# Altium schematic sheet Power.SchDoc
size A; SheetNumber: 4; SheetTotal: 5
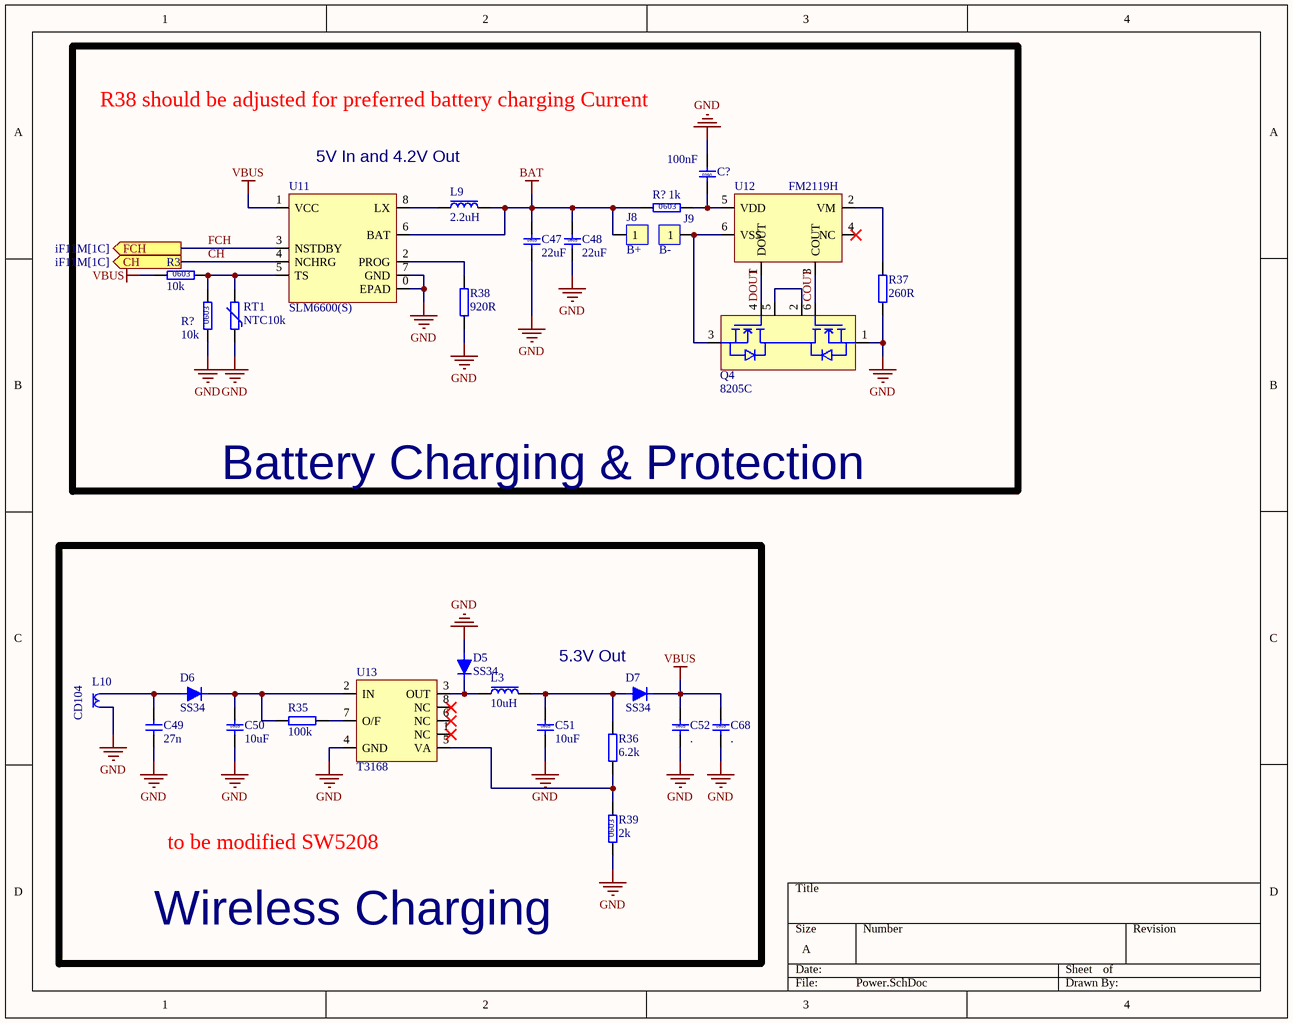
[diagram p0: Power.SchDoc]

## Parts
(Parts that share a designator on the sheet are numbered #1, #2 ... from top to bottom, then left to right.)
C47  22uF  [C0805]
C48  22uF  [C0805]
C49  27n  [C1206]
C50  10uF  [C0805]
C51  10uF  [C0805]
C52  .  [C0805]
C68  .  [C0805]
C?  100nF  [C0603]
D5  SS34  [SMB]
D6  SS34  [SMB]
D7  SS34  [SMB]
J8  B+  [batteryterminal]
J9  B-  [batteryterminal]
L3  10uH  [CD54]
L9  2.2uH  [CD54]
L10  CD104  [SMD PAD 1x2]
Q4  8205C  [SOT23-6]
R3  10k  [R0603-LD]
R35  100k  [R0805]
R36  6.2k  [R0603]
R37  260R  [R0603]
R38  920R  [R0603]
R39  2k  [R0603-LD]
R?#1  1k  [R0603-LD]
R?#2  10k  [R0603-LD]
RT1  NTC10k  [RT0603]
U11  SLM6600(S)  [SOP-8 - EPAD]
U12  FM2119H  [SOT23-6]
U13  T3168  [SOP-8]

## Blocks framed on the sheet
Battery Charging & Protection: C47 C48 C? J8 J9 L9 Q4 R3 R37 R38 R?#1 R?#2 RT1 U11 U12
Wireless Charging: C49-C52 C68 D5-D7 L3 L10 R35 R36 R39 U13

## Ports
CH (out, see iF11M[1C]), FCH (out, see iF11M[1C])

## Nets
BAT: C47.1 C48.1 J8.1 L9.2 R?#1.1 U11.6(BAT)
GND: C47.2 C48.2 C49.1 C50.2 C51.2 C52.2 C68.2 C?.2 D5.1(A) L10.1 Q4.1(S1) R37.1 R38.1 R39.1 R?#2.1 RT1.1 U11.0(EPAD) U11.7(GND) U13.4(GND)
VBUS: C52.1 C68.1 D7.2(K) R3.1 U11.1(VCC)
CH: U11.4(NCHRG) ; port CH
COUT: Q4.6(G1) U12.3(COUT)
DOUT: Q4.4(G2) U12.1(DOUT)
FCH: U11.3(NSTDBY) ; port FCH
NetC49_2: C49.2 D6.1(A) L10.2
NetC50_1: C50.1 D6.2(K) R35.2 U13.2(IN)
NetC51_1: C51.1 D7.1(A) L3.2 R36.2
NetC?_1: C?.1 R?#1.2 U12.5(VDD)
NetD5_2: D5.2(K) L3.1 U13.3(OUT)
NetJ9_1: J9.1 Q4.3(S2) U12.6(VSS)
NetL9_1: L9.1 U11.8(LX)
NetQ4_2: Q4.2(D1) Q4.5(D2)
NetR3_2: R3.2 R?#2.2 RT1.2 U11.5(TS)
NetR35_1: R35.1 U13.7(O/F)
NetR36_1: R36.1 R39.2 U13.5(VA)
NetR37_2: R37.2 U12.2(VM)
NetR38_2: R38.2 U11.2(PROG)

Not connected (* = marked no-connect by the designer): U12 4(NC)*; U13 1(NC)* 6(NC)* 8(NC)*

## Notes on the sheet
- R38 should be adjusted for preferred battery charging Current
- 5V In and 4.2V Out
- (near D7) 5.3V Out
- to be modified SW5208
- (in symbol C 0603 100nF 50V) 0603
- (in symbol C 0805 10uF 25V) 0805
- (in symbol C 0805 22uF 16V) 0805
- (in symbol R 0603 1k) 0603
- (in symbol R 0603 2k) 0603
- (in symbol R 0603 10k) 0603

## Library data of the parts
C47 C48 = C 0805 22uF 16V: 10% 16V; Part No: WP0005367; Material Name: 贴片电容0805 22UF/16V 10%; Product Code: WP0005367; Supplier: 深圳市四叶电子有限公司; Manufacturer: *
C49 = Capacitor: SMD resistor  Package; Part No: *; Product Code: *; Suppliers: 南京南山半导体有限公司; Manufacturer: *
C50-C52 C68 = C 0805 10uF 25V: 10% 25V; Part No: WP0005368; Material Name: 贴片电容0805 10UF/25V 10%; Product Code: WP0005368; Supplier: 深圳市四叶电子有限公司; Manufacturer: *
C? = C 0603 100nF 50V: 10% 50V; Part No: W-T-CA-X703N100K50VNT; Manufacturer: FENGHUA; Material Name: 贴片电容0603 100NF/50V 10%; Product Code: WP0002721; Supplier: 南京南山半导体有限公司
D5-D7 = Diode-smd
J8 J9 = batterypad: 1 Pin SMD Pad for Battery
L3 = CD54: SMD Inductor 10 uH CD54
L9 = CD54: SMD Inductor 2.2 uH CD54
L10 = Wcoil: SMD Inductor
Q4 = JST8205S: 20V N-channel enhancement MOS field effect transistor
R3 R?#2 = R 0603 10k: 5%; Part No: W-T-RE-RS03K103JT; Manufacturer: 热敏D541V11增加1颗用量; Material Name: 贴片电阻0603 10K 5%; Product Code: WP0002708; Supplier: 南京南山半导体有限公司
R35-R38 = Resistor: Part No: *; Product Code: *; Suppliers: 南京南山半导体有限公司; Manufacturer: *
R39 = R 0603 2k: 1%; Part No: W-T-RE-RS03K202FT; Material Name: 贴片电阻0603 2K 1%; Product Code: WP0002768; Supplier: 南京南山半导体有限公司; Manufacturer: *
R?#1 = R 0603 1k: 5%; Part No: W-T-RE-RS03K102JT; Manufacturer: LAGEO; Material Name: 贴片电阻0603 1K  5%; Product Code: WP0002703; Supplier: 南京南山半导体有限公司
RT1 = Thermistor